# Altium schematic sheet SFP.SchDoc
size 420 x 297 mm; SheetNumber: 2; SheetTotal: 6
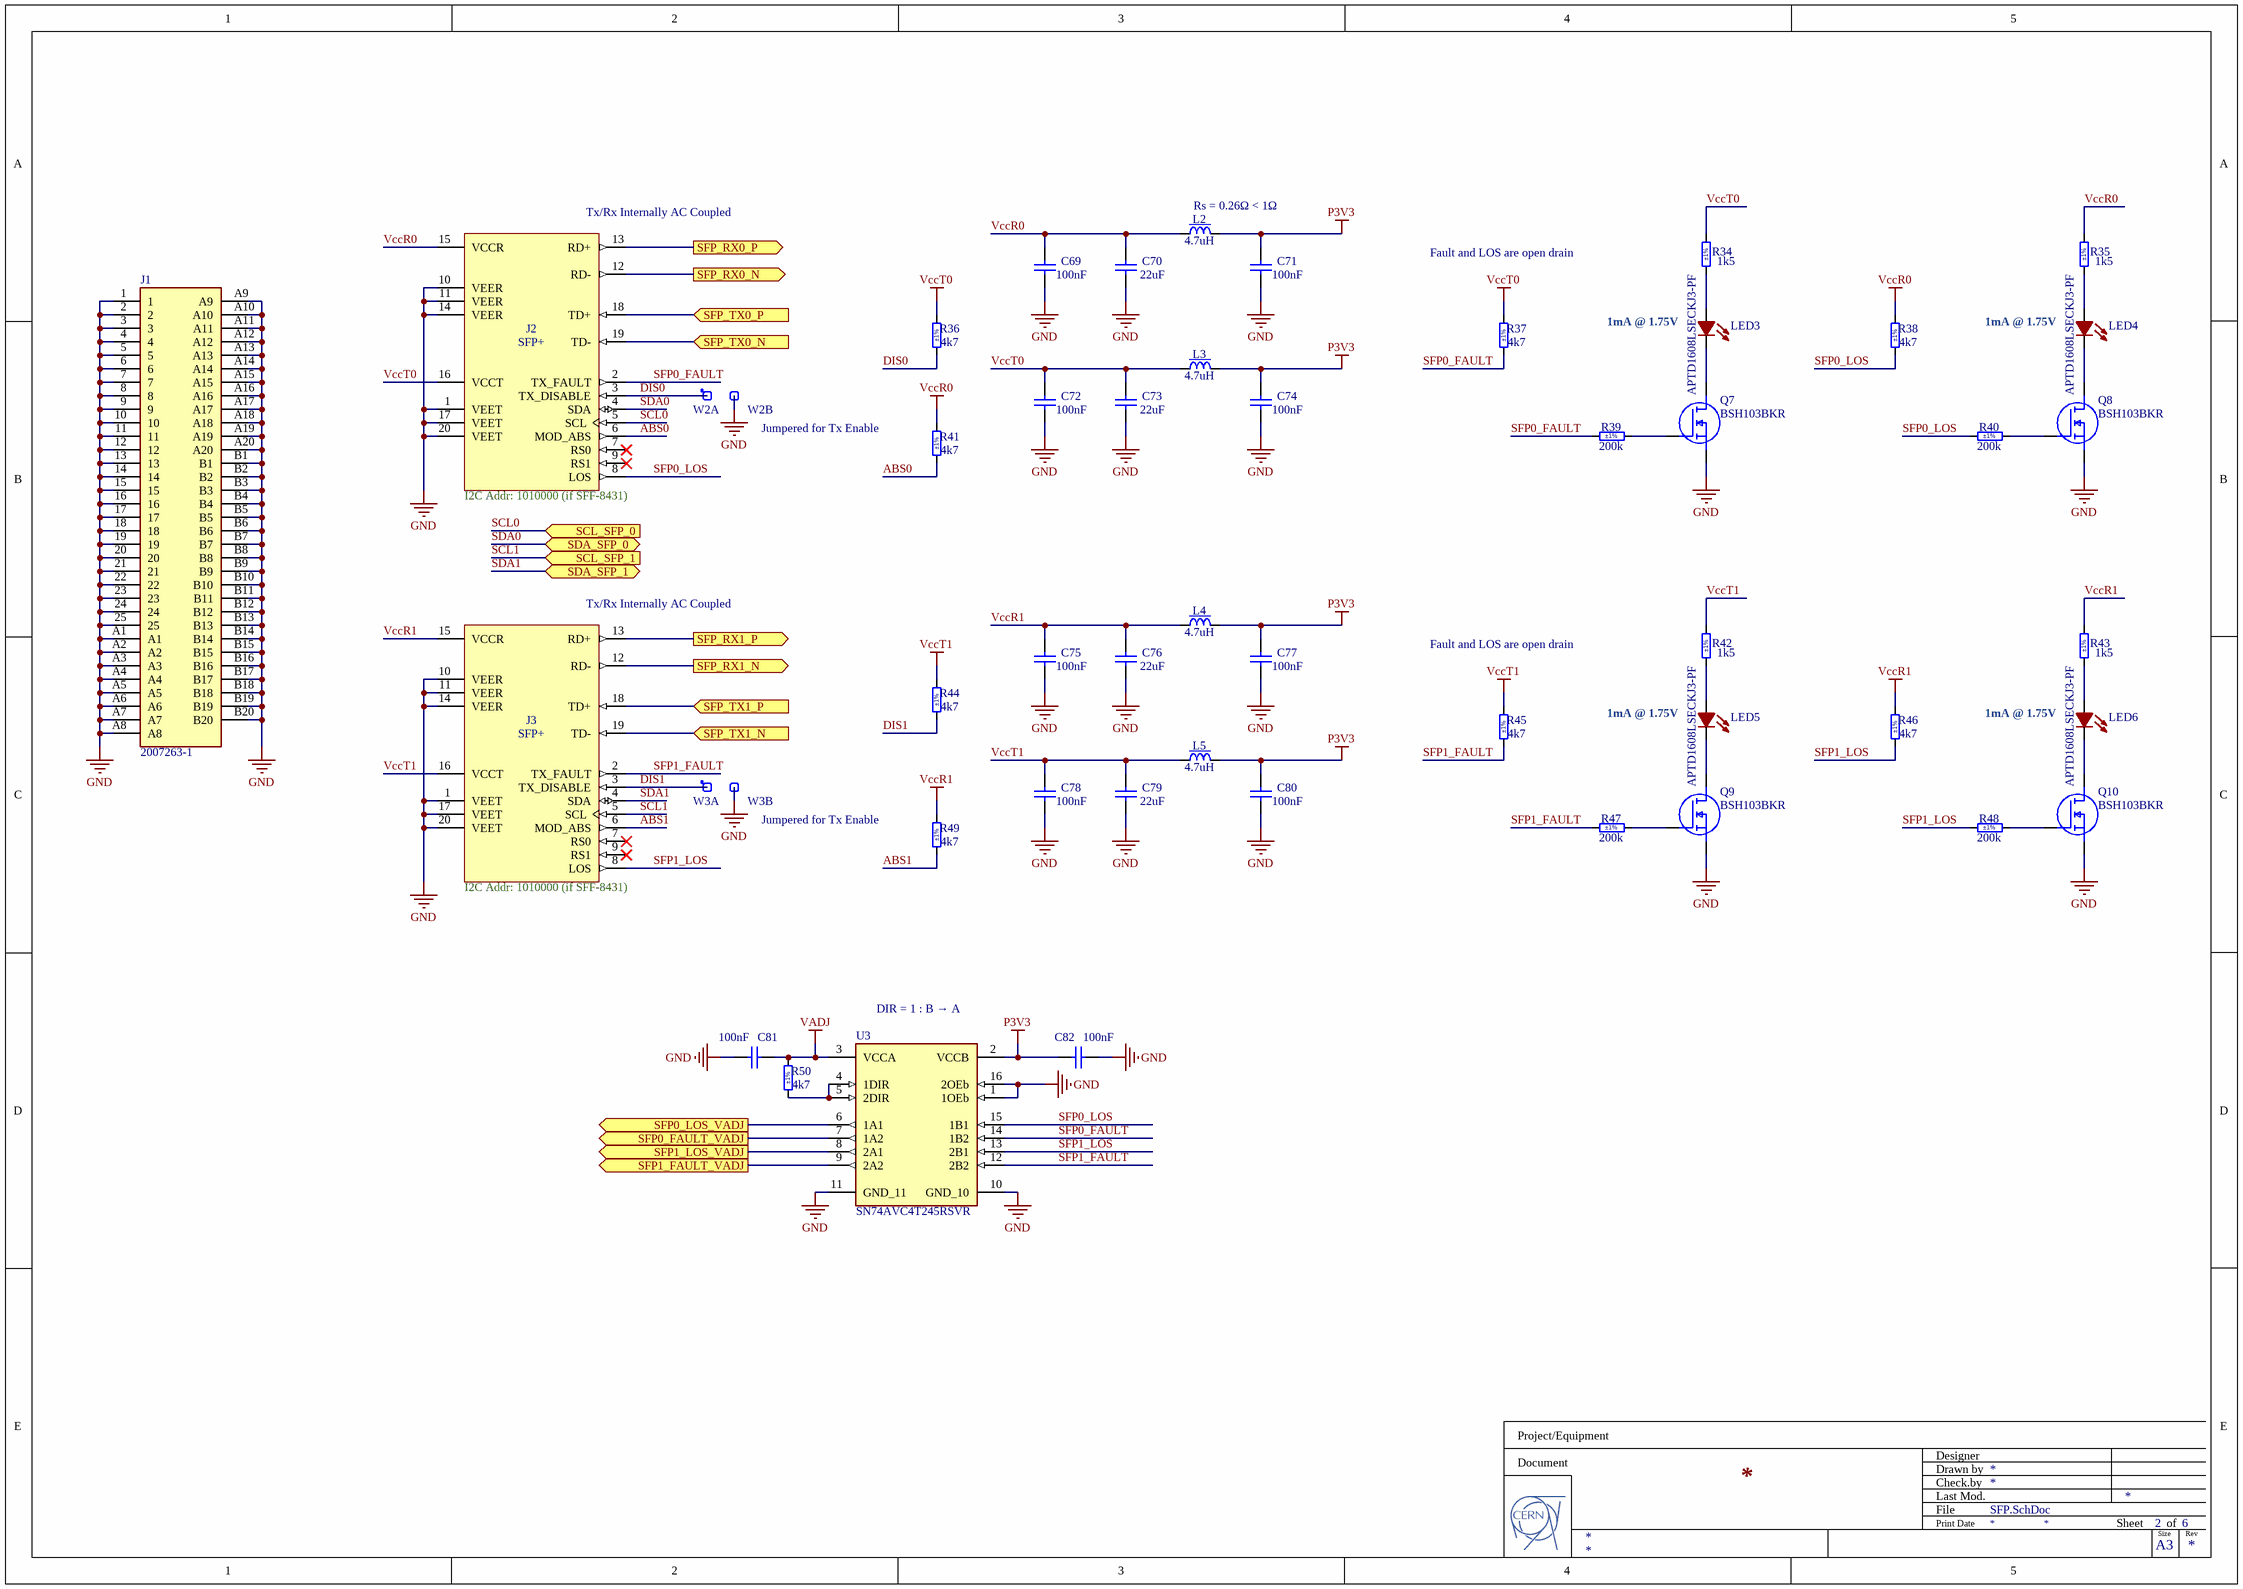
[diagram p0: SFP.SchDoc]

## Parts
C69  100nF  [CAPC0603X33N]
C70  22uF  [CAPC1005X70N]
C71  100nF  [CAPC0603X33N]
C72  100nF  [CAPC0603X33N]
C73  22uF  [CAPC1005X70N]
C74  100nF  [CAPC0603X33N]
C75  100nF  [CAPC0603X33N]
C76  22uF  [CAPC1005X70N]
C77  100nF  [CAPC0603X33N]
C78  100nF  [CAPC0603X33N]
C79  22uF  [CAPC1005X70N]
C80  100nF  [CAPC0603X33N]
C81  100nF  [CAPC0603X33N]
C82  100nF  [CAPC0603X33N]
J1  2007263-1  [20072631]
J2  SFP+  [TYCO_1888247-1]
J3  SFP+  [TYCO_1888247-1]
L2  4.7uH  [IND_MURATA_LQH32C]
L3  4.7uH  [IND_MURATA_LQH32C]
L4  4.7uH  [IND_MURATA_LQH32C]
L5  4.7uH  [IND_MURATA_LQH32C]
LED3  APTD1608LSECKJ3-PF  [LED_APTD1608LSECKJ3-PF_KNB]
LED4  APTD1608LSECKJ3-PF  [LED_APTD1608LSECKJ3-PF_KNB]
LED5  APTD1608LSECKJ3-PF  [LED_APTD1608LSECKJ3-PF_KNB]
LED6  APTD1608LSECKJ3-PF  [LED_APTD1608LSECKJ3-PF_KNB]
Q7  BSH103BKR  [SOT95P230X110-3N]
Q8  BSH103BKR  [SOT95P230X110-3N]
Q9  BSH103BKR  [SOT95P230X110-3N]
Q10  BSH103BKR  [SOT95P230X110-3N]
R34  1k5  Tolerance: ±1%  [RESC1005X40N]
R35  1k5  Tolerance: ±1%  [RESC1005X40N]
R36  4k7  Tolerance: ±1%  [RESC1005X40N]
R37  4k7  Tolerance: ±1%  [RESC1005X40N]
R38  4k7  Tolerance: ±1%  [RESC1005X40N]
R39  200k  Tolerance: ±1%  [RESC1005X40N]
R40  200k  Tolerance: ±1%  [RESC1005X40N]
R41  4k7  Tolerance: ±1%  [RESC1005X40N]
R42  1k5  Tolerance: ±1%  [RESC1005X40N]
R43  1k5  Tolerance: ±1%  [RESC1005X40N]
R44  4k7  Tolerance: ±1%  [RESC1005X40N]
R45  4k7  Tolerance: ±1%  [RESC1005X40N]
R46  4k7  Tolerance: ±1%  [RESC1005X40N]
R47  200k  Tolerance: ±1%  [RESC1005X40N]
R48  200k  Tolerance: ±1%  [RESC1005X40N]
R49  4k7  Tolerance: ±1%  [RESC1005X40N]
R50  4k7  Tolerance: ±1%  [RESC1005X40N]
U3  SN74AVC4T245RSVR  [QFN40P260X180X55-16N]
W2  Header 2  [SAMTEC_HTSW-102-23-L-S]  (value not drawn)  (parts A,B of 2)
W3  Header 2  [SAMTEC_HTSW-102-23-L-S]  (value not drawn)  (parts A,B of 2)

## Ports
SCL_SFP_0 (in), SCL_SFP_1 (in), SDA_SFP_0 (bidir), SDA_SFP_1 (bidir), SFP0_FAULT_VADJ (out), SFP0_LOS_VADJ (out), SFP1_FAULT_VADJ (out), SFP1_LOS_VADJ (out), SFP_RX0_N (out), SFP_RX0_P (out), SFP_RX1_N (out), SFP_RX1_P (out), SFP_TX0_N (in), SFP_TX0_P (in), SFP_TX1_N (in), SFP_TX1_P (in)

## Nets
GND: C69.1 C70.1 C71.1 C72.1 C73.1 C74.1 C75.1 C76.1 C77.1 C78.1 C79.1 C80.1 C81.1 C82.1 J1.1 J1.2 J1.3 J1.4 J1.5 J1.6 J1.7 J1.8 J1.9 J1.10 J1.11 J1.12 J1.13 J1.14 J1.15 J1.16 J1.17 J1.18 J1.19 J1.20 J1.21 J1.22 J1.23 J1.24 J1.25 J1.A1 J1.A2 J1.A3 J1.A4 J1.A5 J1.A6 J1.A7 J1.A8 J1.A9 J1.A10 J1.A11 J1.A12 J1.A13 J1.A14 J1.A15 J1.A16 J1.A17 J1.A18 J1.A19 J1.A20 J1.B1 J1.B2 J1.B3 J1.B4 J1.B5 J1.B6 J1.B7 J1.B8 J1.B9 J1.B10 J1.B11 J1.B12 J1.B13 J1.B14 J1.B15 J1.B16 J1.B17 J1.B18 J1.B19 J1.B20 J2.1(VEET) J2.10(VEER) J2.11(VEER) J2.14(VEER) J2.17(VEET) J2.20(VEET) J3.1(VEET) J3.10(VEER) J3.11(VEER) J3.14(VEER) J3.17(VEET) J3.20(VEET) Q7.2(S) Q8.2(S) Q9.2(S) Q10.2(S) U3.1(1OEb) U3.10(GND_10) U3.11(GND_11) U3.16(2OEb) W2.2 W3.2
P3V3: C71.2 C74.2 C77.2 C80.2 C82.2 L2.2 L3.2 L4.2 L5.2 U3.2(VCCB)
VADJ: C81.2 R50.2 U3.3(VCCA)
VccR0: C69.2 C70.2 J2.15(VCCR) L2.1 R35.2 R38.2 R41.2
VccR1: C75.2 C76.2 J3.15(VCCR) L4.1 R43.2 R46.2 R49.2
VccT0: C72.2 C73.2 J2.16(VCCT) L3.1 R34.2 R36.2 R37.2
VccT1: C78.2 C79.2 J3.16(VCCT) L5.1 R42.2 R44.2 R45.2
ABS0: J2.6(MOD_ABS) R41.1
ABS1: J3.6(MOD_ABS) R49.1
DIS0: J2.3(TX_DISABLE) R36.1 W2.1
DIS1: J3.3(TX_DISABLE) R44.1 W3.1
SCL0: J2.5(SCL) ; port SCL_SFP_0
SCL1: J3.5(SCL) ; port SCL_SFP_1
SDA0: J2.4(SDA) ; port SDA_SFP_0
SDA1: J3.4(SDA) ; port SDA_SFP_1
SFP0_FAULT: J2.2(TX_FAULT) R37.1 R39.1 U3.14(1B2)
SFP0_FAULT_VADJ: U3.7(1A2) ; port SFP0_FAULT_VADJ
SFP0_LOS: J2.8(LOS) R38.1 R40.1 U3.15(1B1)
SFP0_LOS_VADJ: U3.6(1A1) ; port SFP0_LOS_VADJ
SFP1_FAULT: J3.2(TX_FAULT) R45.1 R47.1 U3.12(2B2)
SFP1_FAULT_VADJ: U3.9(2A2) ; port SFP1_FAULT_VADJ
SFP1_LOS: J3.8(LOS) R46.1 R48.1 U3.13(2B1)
SFP1_LOS_VADJ: U3.8(2A1) ; port SFP1_LOS_VADJ
SFP_RX0_N: J2.12(RD-) ; port SFP_RX0_N
SFP_RX0_P: J2.13(RD+) ; port SFP_RX0_P
SFP_RX1_N: J3.12(RD-) ; port SFP_RX1_N
SFP_RX1_P: J3.13(RD+) ; port SFP_RX1_P
SFP_TX0_N: J2.19(TD-) ; port SFP_TX0_N
SFP_TX0_P: J2.18(TD+) ; port SFP_TX0_P
SFP_TX1_N: J3.19(TD-) ; port SFP_TX1_N
SFP_TX1_P: J3.18(TD+) ; port SFP_TX1_P
NetLED3_1: LED3.1(C) Q7.3(D)
NetLED3_2: LED3.2(A) R34.1
NetLED4_1: LED4.1(C) Q8.3(D)
NetLED4_2: LED4.2(A) R35.1
NetLED5_1: LED5.1(C) Q9.3(D)
NetLED5_2: LED5.2(A) R42.1
NetLED6_1: LED6.1(C) Q10.3(D)
NetLED6_2: LED6.2(A) R43.1
NetQ7_1: Q7.1(G) R39.2
NetQ8_1: Q8.1(G) R40.2
NetQ9_1: Q9.1(G) R47.2
NetQ10_1: Q10.1(G) R48.2
NetR50_1: R50.1 U3.4(1DIR) U3.5(2DIR)

Not connected (* = marked no-connect by the designer): J2 7(RS0)* 9(RS1)*; J3 7(RS0)* 9(RS1)*

## Notes on the sheet
- (near J2) Tx/Rx Internally AC Coupled
- (near L2) Rs = 0.26Ω < 1Ω
- Fault and LOS are open drain
- (near LED3) 1mA @ 1.75V
- (near LED4) 1mA @ 1.75V
- Jumpered for Tx Enable
- (near J2) I2C Addr: 1010000 (if SFF-8431)
- (near J3) Tx/Rx Internally AC Coupled
- (near LED5) 1mA @ 1.75V
- (near LED6) 1mA @ 1.75V
- (near J3) I2C Addr: 1010000 (if SFF-8431)
- (near U3) DIR = 1 : B → A
- Project/Equipment
- Document
- Designer
- Drawn by
- Check.by
- File
- Last Mod.
- Print Date
- Sheet
- Size
- A3
- of
- Rev

## Library data of the parts
C69 C71 C72 C74 C75 C77 C78 C80 = CC0201_100NF_6.3V_10%_X7R: Non-polarised capacitor; Part Description: SMD Multilayer Chip Ceramic Capacitor; Manufacturer: GENERIC; Manufacturer1 Part Number: CC0201KRX7R5BB104; Voltage: 6.3V; TC: X7R; Tolerance: ±10%; Part Number: CC0201_100NF_6.3V_10%_X7R; Component Kind: Standard; Component Type: Standard; Pin Count: 2; Value: 100nF; Status: Not Recommended; Manufacturer Part Number: CC0201_100NF_6.3V_10%_X7R; Case: 0201; Mounted: Yes; Socket: No; SMD: Yes; Sense: No; Manufacturer1 Example: YAGEO PHYCOMP; Manufacturer1 ComponentHeight: 0.33mm; HelpURL: \\cern.ch\dfs\Applications\Altium\Datasheets\CC0201_X7R_YAGEO_6.3VTO50V.pdf; Author: CERN DEM BC; CreateDate: 11/20/2020; LatestRevisionDate: 11/20/2020
C70 C73 C76 C79 = CC0402_10UF_6.3V_20%_X5R: GRM155R60J226ME11; Part Description: SMD Multilayer Chip Ceramic Capacitor; Manufacturer: GENERIC; Manufacturer1 Part Number: C1005X5R0J106M050; Value: 10uF; Voltage: 6.3V; TC: X5R; Tolerance: ±10%; Part Number: CC0402_10UF_6.3V_20%_X5R; Component Kind: Standard; Component Type: Standard; Pin Count: 2; Status: Preferred; Manufacturer Part Number: CC0402_10UF_6.3V_20%_X5R; Case: 0402; Mounted: Yes; Socket: No; SMD: Yes; Sense: No; Manufacturer1 Example: TDK; Manufacturer1 ComponentHeight: 0.70mm; HelpURL: \\cern.ch\dfs\Applications\Altium\Datasheets\CC0402_X5R_TDK_C.pdf; Author: CERN DEM JLC; CreateDate: 1/7/2015; LatestRevisionDate: 1/7/2015
C81 C82 = CC0201_100NF_6.3V_10%_X5R: GRM033R61C104KE14; Part Description: SMD Multilayer Chip Ceramic Capacitor; Manufacturer: GENERIC; Manufacturer1 Part Number: 02016D104KAT2A; Voltage: 6.3V; TC: X5R; Tolerance: ±10%; Part Number: CC0201_100NF_6.3V_10%_X5R; Component Kind: Standard; Component Type: Standard; Pin Count: 2; Value: 100nF; Status: Not Recommended; Manufacturer Part Number: CC0201_100NF_6.3V_10%_X5R; Case: 0201; Mounted: Yes; Socket: No; SMD: Yes; Sense: No; Manufacturer1 Example: AVX; Manufacturer1 ComponentHeight: 0.33mm; HelpURL: \\cern.ch\dfs\Applications\Altium\Datasheets\CC0201_X5R_AVX.pdf; Author: CERN DEM JLC; CreateDate: 12/3/2007; LatestRevisionDate: 12/3/2007
J1 = 2007263-1: Connector; Manufacturer_Name: TE Connectivity; Datasheet Link: https://www.te.com/commerce/DocumentDelivery/DDEController?Action=srchrtrv&DocNm=4-1773455-3_Quick_Ref_Guide_SFP%2B_Sol&DocType=Data%20Sheet&DocLang=English&PartCntxt=2007263-1&DocFormat=pdf; Height: 9.8mm; Manufacturer_Part_Number: 2007263-1; Mouser Part Number: 571-2007263-1; Mouser Price/Stock: https://www.mouser.co.uk/ProductDetail/TE-Connectivity/2007263-1?qs=4zF2lffhceF8GItBX4M8mw%3D%3D; Arrow Part Number: 2007263-1; Arrow Price/Stock: https://www.arrow.com/en/products/2007263-1/te-connectivity?region=europe
J2 J3 = TYCO_1888247-1: 20 Position SFP+ Connector (Small Form-factor Pluggable); Part Description: 20 Position, Pitch 0.8mm SFP+ Receptacle (Small Form-factor Pluggable); Manufacturer: TYCO ELECTRONICS; PressFit: No; Part Number: TYCO_1888247-1; Component Kind: Standard; Component Type: Standard; Pin Count: 20; Family: SFP+; Mounted: Yes; Socket: No; SMD: Yes; Sense: No; Status: None; Manufacturer Part Number: 1888247-1; ComponentHeight: 5.4mm; HelpURL: \\cern.ch\dfs\Applications\Altium\Datasheets\TYCO_1888247-1.pdf; Author: CERN DEM JLC; CreateDate: 2/27/2012; LatestRevisionDate: 2/27/2012
L2-L5 = IND_4.7UH_20%_MURATA_LQH32CN4R7M23L: Inductor With Core. Rs = 0.26Ω < 1Ω; Part Description: Chip Inductor (Chip Coil) for Choke Wire Wound Type; Manufacturer: MURATA; Power: 450mA; Resistance: 0.2R; Tolerance: ±20%; Part Number: IND_4.7UH_20%_MURATA_LQH32CN4R7M23L; Component Kind: Standard; Component Type: Standard; Pin Count: 2; Value: 4.7uH; Manufacturer Part Number: LQH32CN4R7M23; Mounted: Yes; Socket: No; SMD: Yes; Sense: No; ComponentHeight: 2.2mm; HelpURL: \\cern.ch\dfs\Applications\Altium\Datasheets\IND_MURATA_LQH32CN_23.pdf; Author: CERN DEM JLC; CreateDate: 4/20/2010; LatestRevisionDate: 7/4/2018
LED3-LED6 = APTD1608LSECKJ3-PF: Led Red 0603 2mA 1.8V 50mcd 84mW; Mfr_Name: Kingbright
Q7-Q10 = BSH103BKR: MOSFET (N-Channel); Manufacturer_Name: Nexperia; Datasheet Link: https://ms.componentsearchengine.com/Datasheets/2/BSH103BKR.pdf; Height: 1.1mm; Manufacturer_Part_Number: BSH103BKR; Mouser Part Number: 771-BSH103BKR; Mouser Price/Stock: https://www.mouser.co.uk/ProductDetail/Nexperia/BSH103BKR?qs=GCAb4wyKXLKD%2FWt2ta8c7Q%3D%3D; Arrow Part Number: BSH103BKR; Arrow Price/Stock: https://www.arrow.com/en/products/bsh103bkr/nexperia?region=europe
R34 R35 R42 R43 = R0402_1K5_1%_0.0625W_100PPM: Resistor - 1%; Part Description: General Purpose Thick Film Chip Resistor; Manufacturer: GENERIC; Manufacturer1 Part Number: 232270671502L; TC: ±100ppm/°C; PressFit: No; Part Number: R0402_1K5_1%_0.0625W_100PPM; Component Kind: Standard; Component Type: Standard; Pin Count: 2; Value: 1k5; Status: Not Recommended; Power: 0.0625W; Manufacturer Part Number: R0402_1K5_1%_0.0625W_100PPM; Case: 0402; Mounted: Yes; Sense: No; Socket: No; SMD: Yes; Manufacturer1 Example: YAGEO PHYCOMP; Manufacturer1 ComponentHeight: 0.4mm; HelpURL: \\cern.ch\dfs\Applications\Altium\Datasheets\R0402_Phycomp_RC0402.pdf; Author: CERN DEM JLC; CreateDate: 12/3/2007; LatestRevisionDate: 10/17/2012
R36-R38 R41 R44-R46 R49 R50 = R0402_4K7_1%_0.0625W_100PPM: Resistor - 1%; Part Description: General Purpose Thick Film Chip Resistor; Manufacturer: GENERIC; Manufacturer1 Part Number: 232270674702L; TC: ±100ppm/°C; PressFit: No; Part Number: R0402_4K7_1%_0.0625W_100PPM; Component Kind: Standard; Component Type: Standard; Pin Count: 2; Value: 4k7; Status: Not Recommended; Power: 0.0625W; Manufacturer Part Number: R0402_4K7_1%_0.0625W_100PPM; Case: 0402; Mounted: Yes; Sense: No; Socket: No; SMD: Yes; Manufacturer1 Example: YAGEO PHYCOMP; Manufacturer1 ComponentHeight: 0.4mm; HelpURL: \\cern.ch\dfs\Applications\Altium\Datasheets\R0402_Phycomp_RC0402.pdf; Author: CERN DEM JLC; CreateDate: 12/3/2007; LatestRevisionDate: 10/17/2012
R39 R40 R47 R48 = R0402_200K_1%_0.0625W_100PPM: Resistor - 1%; Part Description: General Purpose Thick Film Chip Resistor; Manufacturer: GENERIC; Manufacturer1 Part Number: 232270672004L; TC: ±100ppm/°C; PressFit: No; Part Number: R0402_200K_1%_0.0625W_100PPM; Component Kind: Standard; Component Type: Standard; Pin Count: 2; Value: 200k; Status: Not Recommended; Power: 0.0625W; Manufacturer Part Number: R0402_200K_1%_0.0625W_100PPM; Case: 0402; Mounted: Yes; Sense: No; Socket: No; SMD: Yes; Manufacturer1 Example: YAGEO PHYCOMP; Manufacturer1 ComponentHeight: 0.4mm; HelpURL: \\cern.ch\dfs\Applications\Altium\Datasheets\R0402_Phycomp_RC0402.pdf; Author: CERN DEM JLC; CreateDate: 12/3/2007; LatestRevisionDate: 10/17/2012
U3 = SN74AVC4T245RSVR: 4-Bit Dual-Supply Bus Transceiver with Configurable Voltage-Level Shifting and 3-State Outputs 16-UQFN -40 to 85; MF: Texas Instruments; Purchase-URL: https://pricing.snapeda.com/search/part/SN74AVC4T245RSVR/?ref=eda; Price: None; SnapEDA_Link: https://www.snapeda.com/parts/SN74AVC4T245RSVR/Texas%20Instruments/view-part/553822/?ref=snap; Package: UQFN-16 Texas Instruments; Availability: Good; Value: *; MP: SN74AVC4T245RSVR
W2 W3 = SAMTEC_HTSW-102-23-L-S: 2 Mini Wire-Wrap Contact Strip Header; Part Description: 2 Contacts, Pitch 2.54mm, Single Row  Through Mount Straight Header (Post Lead 5.84mm, Tail Lead 2.92mm, Insulator 2.54mm); Manufacturer: SAMTEC; PressFit: No; Status Comment: High Temperature; Part Number: SAMTEC_HTSW-102-23-L-S; Component Kind: Standard; Component Type: Standard; Pin Count: 2; Family: Header 2; Mounted: Yes; Socket: No; SMD: No; Sense: No; Status: Preferred; Manufacturer Part Number: HTSW-102-23-L-S; ComponentHeight: 8.38mm; HelpURL: \\cern.ch\dfs\Applications\Altium\Datasheets\SAMTEC_HTSW-102-23-L-S.pdf; Author: CERN DEM JLC; CreateDate: 2/22/2018; LatestRevisionDate: 2/22/2018